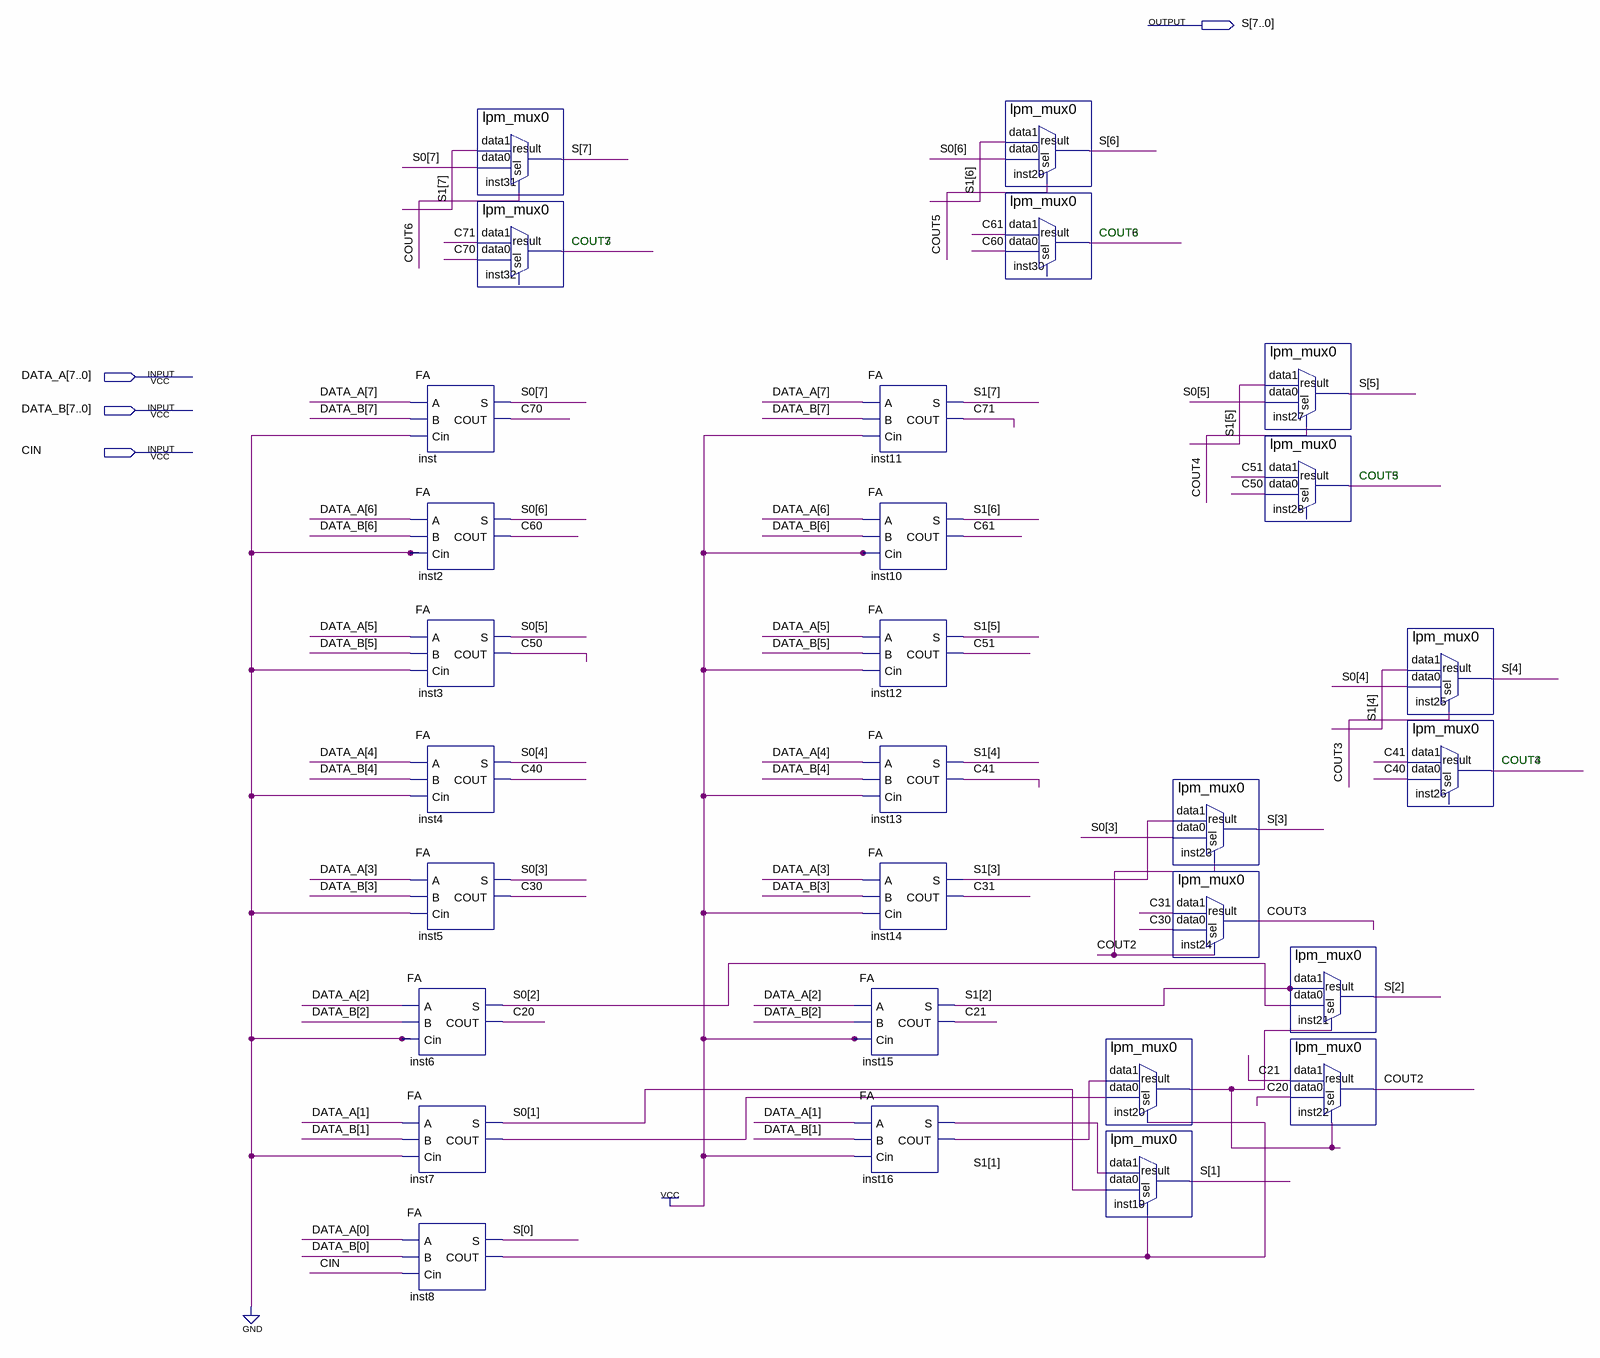
[diagram p0: schematic sheet]
// Quartus schematic SC.bdf as structural Verilog: 29 symbols, 4 pins
module SC (
  input  [7:0] DATA_A,
  input  [7:0] DATA_B,
  input  CIN,
  output [7:0] S
);

  wire C20, C21, C30, C31, C40, C41, C50, C51, C60, C61, C70, C71, COUT2, COUT3, COUT4, COUT5, COUT6, COUT7,
       inst7_cout, inst8_cout, inst16_cout, inst20_result;
  wire [7:1] S0, S1;

  FA inst (.A(DATA_A[7]), .B(DATA_B[7]), .Cin(1'b0), .S(S0[7]), .COUT(C70));
  FA inst2 (.A(DATA_A[6]), .B(DATA_B[6]), .Cin(1'b0), .S(S0[6]), .COUT(C60));
  FA inst3 (.A(DATA_A[5]), .B(DATA_B[5]), .Cin(1'b0), .S(S0[5]), .COUT(C50));
  FA inst4 (.A(DATA_A[4]), .B(DATA_B[4]), .Cin(1'b0), .S(S0[4]), .COUT(C40));
  FA inst5 (.A(DATA_A[3]), .B(DATA_B[3]), .Cin(1'b0), .S(S0[3]), .COUT(C30));
  FA inst6 (.A(DATA_A[2]), .B(DATA_B[2]), .Cin(1'b0), .S(S0[2]), .COUT(C20));
  FA inst7 (.A(DATA_A[1]), .B(DATA_B[1]), .Cin(1'b0), .S(S0[1]), .COUT(inst7_cout));
  FA inst8 (.A(DATA_A[0]), .B(DATA_B[0]), .Cin(CIN), .S(S[0]), .COUT(inst8_cout));
  lpm_mux0 inst31 (.data1(S1[7]), .data0(S0[7]), .sel(COUT6), .result(S[7]));
  lpm_mux0 inst32 (.data1(C71), .data0(C70), .result(COUT7));  // open: sel
  FA inst11 (.A(DATA_A[7]), .B(DATA_B[7]), .Cin(1'b1), .S(S1[7]), .COUT(C71));
  FA inst10 (.A(DATA_A[6]), .B(DATA_B[6]), .Cin(1'b1), .S(S1[6]), .COUT(C61));
  FA inst12 (.A(DATA_A[5]), .B(DATA_B[5]), .Cin(1'b1), .S(S1[5]), .COUT(C51));
  FA inst13 (.A(DATA_A[4]), .B(DATA_B[4]), .Cin(1'b1), .S(S1[4]), .COUT(C41));
  FA inst14 (.A(DATA_A[3]), .B(DATA_B[3]), .Cin(1'b1), .S(S1[3]), .COUT(C31));
  FA inst15 (.A(DATA_A[2]), .B(DATA_B[2]), .Cin(1'b1), .S(S1[2]), .COUT(C21));
  FA inst16 (.A(DATA_A[1]), .B(DATA_B[1]), .Cin(1'b1), .S(S1[1]), .COUT(inst16_cout));
  lpm_mux0 inst29 (.data1(S1[6]), .data0(S0[6]), .sel(COUT5), .result(S[6]));
  lpm_mux0 inst30 (.data1(C61), .data0(C60), .result(COUT6));  // open: sel
  lpm_mux0 inst20 (.data1(inst16_cout), .data0(inst7_cout), .sel(inst8_cout), .result(inst20_result));
  lpm_mux0 inst19 (.data1(S1[1]), .data0(S0[1]), .sel(inst8_cout), .result(S[1]));
  lpm_mux0 inst23 (.data1(S1[3]), .data0(S0[3]), .sel(COUT2), .result(S[3]));
  lpm_mux0 inst24 (.data1(C31), .data0(C30), .sel(COUT2), .result(COUT3));
  lpm_mux0 inst27 (.data1(S1[5]), .data0(S0[5]), .sel(COUT4), .result(S[5]));
  lpm_mux0 inst28 (.data1(C51), .data0(C50), .result(COUT5));  // open: sel
  lpm_mux0 inst21 (.data1(S1[2]), .data0(S0[2]), .sel(inst20_result), .result(S[2]));
  lpm_mux0 inst22 (.data1(C21), .data0(C20), .sel(inst20_result), .result(COUT2));
  lpm_mux0 inst25 (.data1(S1[4]), .data0(S0[4]), .sel(COUT3), .result(S[4]));
  lpm_mux0 inst26 (.data1(C41), .data0(C40), .result(COUT4));  // open: sel

  // Notes on the sheet:
  //   COUT3
  //   COUT3
  //   COUT3
  //   COUT3
endmodule
